# Altium project JD_BopIt.PrjPcb
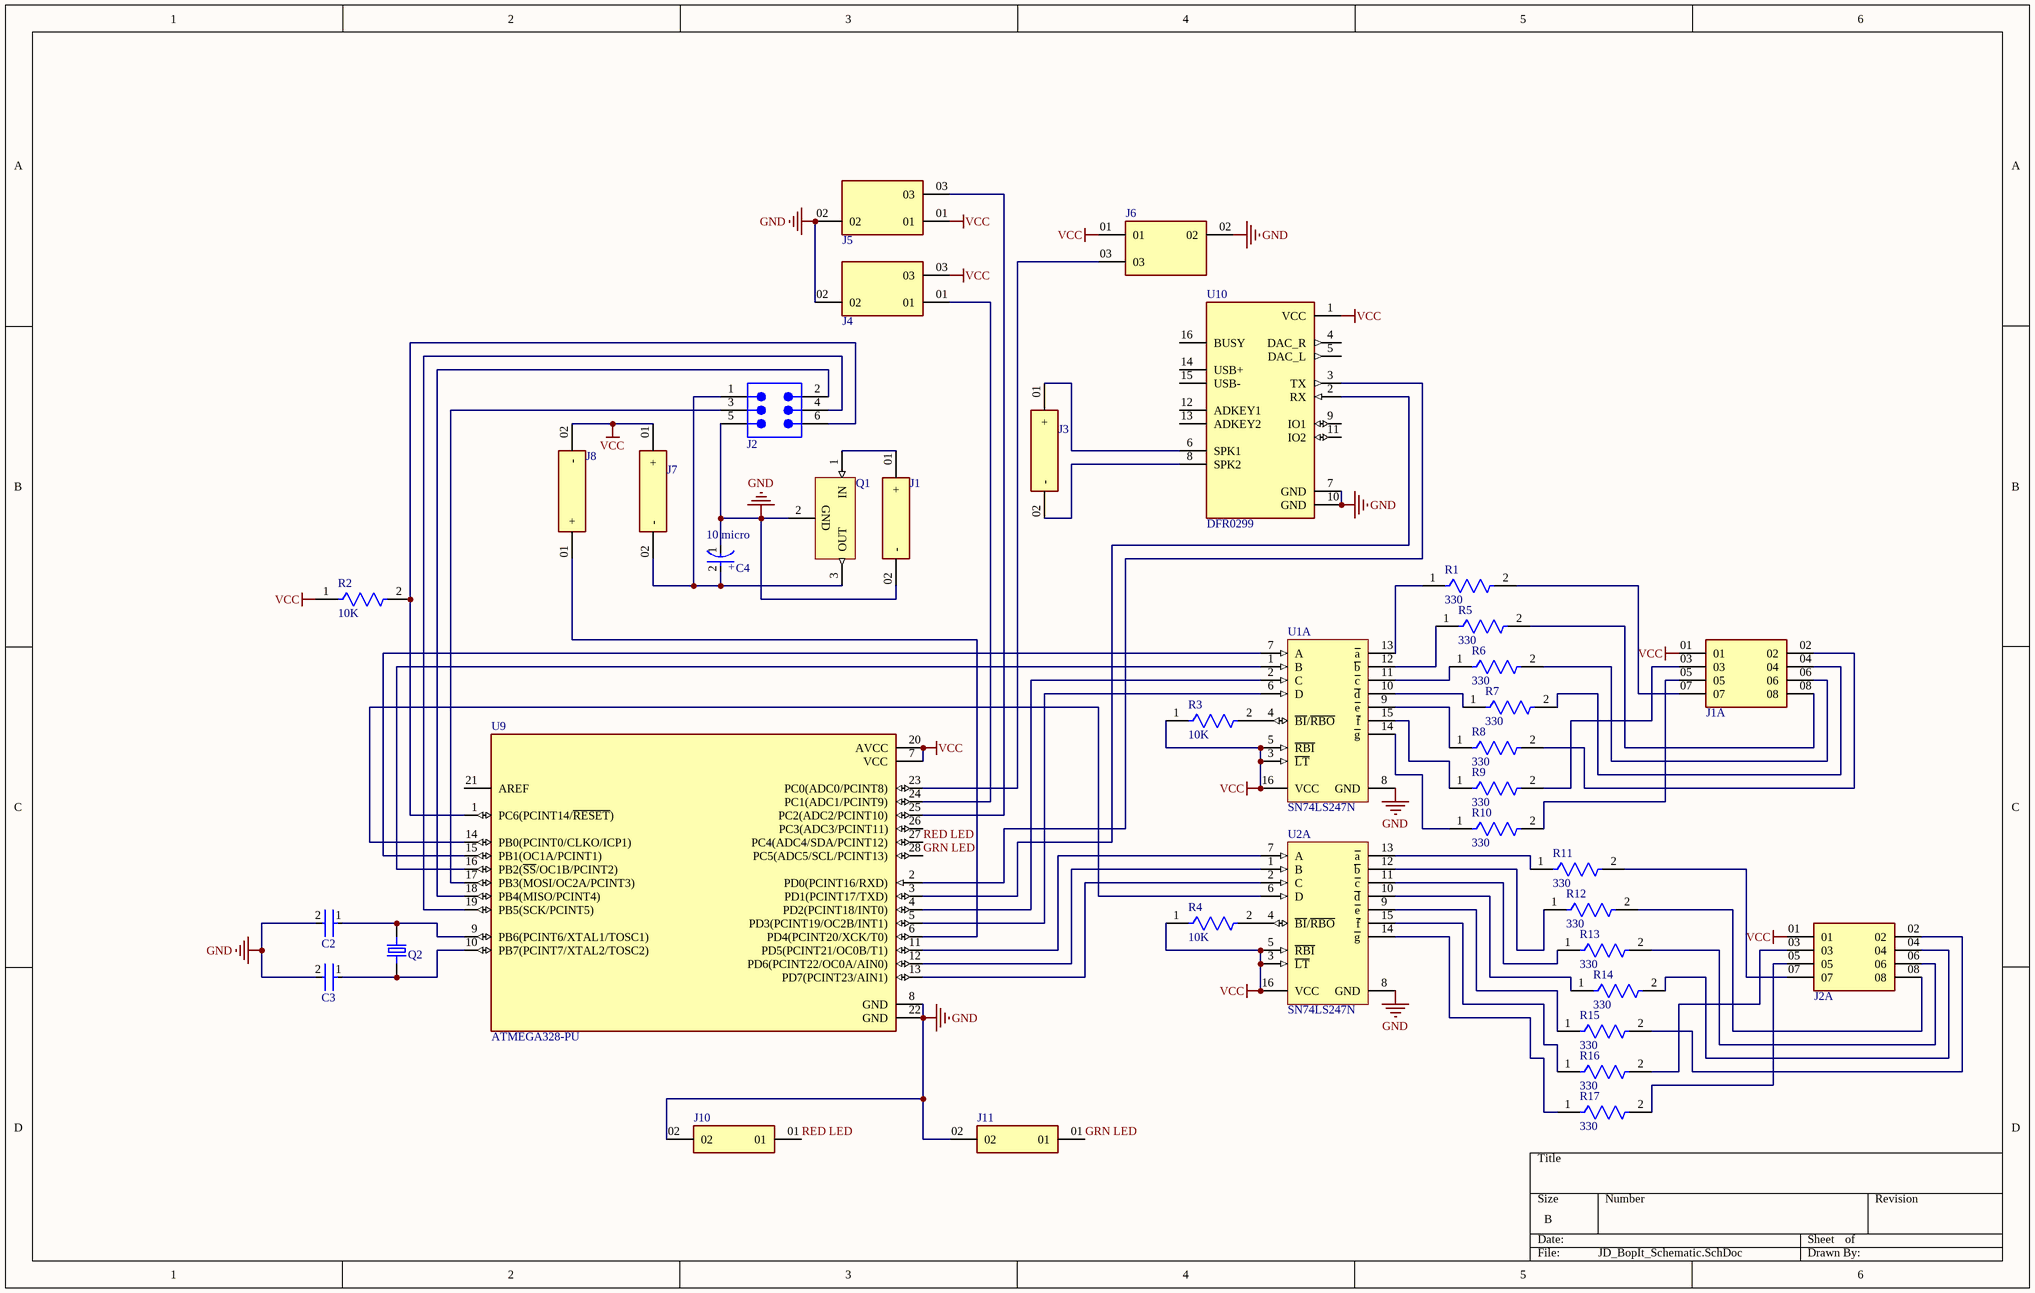
[diagram p0: JD_BopIt_Schematic.SchDoc]
1 sheet, 38 parts. Net scope: global (net labels, ports and power ports of the same name join across sheets).
Board file: JD_BopIt_PCB.PcbDoc

## Sheet JD_BopIt_Schematic.SchDoc
size B; SheetNumber: 1; SheetTotal: 1

### Parts
C2  RCE5C2A220J0DBH03A  [FP-RCE0DB-MFG]  (value not drawn)
C3  RCE5C2A220J0DBH03A  [FP-RCE0DB-MFG]  (value not drawn)
C4  10 micro  [FP-173DW-MFG]
J1  MTSW-101-09-T-D-231-LL  [SAMTEC_MTSW-101-09-T-D-231-LL]  (value not drawn)
J1A  TSW-104-09-L-D  [SAMTEC_TSW-104-09-L-D]  (value not drawn)
J2  61200621621  [61200621621]  (value not drawn)
J2A  TSW-104-09-L-D  [SAMTEC_TSW-104-09-L-D]  (value not drawn)
J3  MTSW-101-09-T-D-231-LL  [SAMTEC_MTSW-101-09-T-D-231-LL]  (value not drawn)
J4  HTSW-101-07-S-T  [SAMTEC_HTSW-101-07-S-T]  (value not drawn)
J5  HTSW-101-07-S-T  [SAMTEC_HTSW-101-07-S-T]  (value not drawn)
J6  HTSW-101-07-S-T  [SAMTEC_HTSW-101-07-S-T]  (value not drawn)
J7  MTSW-101-09-T-D-231-LL  [SAMTEC_MTSW-101-09-T-D-231-LL]  (value not drawn)
J8  MTSW-101-09-T-D-231-LL  [SAMTEC_MTSW-101-09-T-D-231-LL]  (value not drawn)
J10  MTSW-101-09-T-D-231-LL  [SAMTEC_MTSW-101-09-T-D-231-LL]  (value not drawn)
J11  MTSW-101-09-T-D-231-LL  [SAMTEC_MTSW-101-09-T-D-231-LL]  (value not drawn)
Q1  LM7805CT  [FAIR-TO-220-3]  (value not drawn)
Q2  ECS-160-S-4  [XTAL_ECS-160-20-4X]  (value not drawn)
R1  330  [FP-MBB0207-MFG]
R2  10K  [FP-MBB0207-MFG]
R3  10K  [FP-MBB0207-MFG]
R4  10K  [FP-MBB0207-MFG]
R5  330  [FP-MBB0207-MFG]
R6  330  [FP-MBB0207-MFG]
R7  330  [FP-MBB0207-MFG]
R8  330  [FP-MBB0207-MFG]
R9  330  [FP-MBB0207-MFG]
R10  330  [FP-MBB0207-MFG]
R11  330  [FP-MBB0207-MFG]
R12  330  [FP-MBB0207-MFG]
R13  330  [FP-MBB0207-MFG]
R14  330  [FP-MBB0207-MFG]
R15  330  [FP-MBB0207-MFG]
R16  330  [FP-MBB0207-MFG]
R17  330  [FP-MBB0207-MFG]
U1A  SN74LS247N  [N0016A]
U2A  SN74LS247N  [N0016A]
U9  ATMEGA328-PU  [DIP787W46P254L3467H508Q28]
U10  DFR0299  [MODULE_DFR0299]

### Nets
GND: C2.2 C3.2 C4.1(C) J1.02(-) J2.5 J4.02 J5.02 J6.02 J10.02 J11.02 Q1.2(GND) U1A.8(GND) U2A.8(GND) U9.8(GND) U9.22(GND) U10.7(GND) U10.10(GND)
VCC: J1A.01 J2A.01 J4.03 J5.01 J6.01 J7.01(+) J8.02(-) R2.1 R3.1 R4.1 U1A.3(~{LT}) U1A.5(~{RBI}) U1A.16(VCC) U2A.3(~{LT}) U2A.5(~{RBI}) U2A.16(VCC) U9.7(VCC) U9.20(AVCC) U10.1(VCC)
GRN LED: J11.01 U9.28(PC5(ADC5/SCL/PCINT13))
RED LED: J10.01 U9.27(PC4(ADC4/SDA/PCINT12))
NetC2_1: C2.1 Q2.2 U9.9(PB6(PCINT6/XTAL1/TOSC1))
NetC3_1: C3.1 Q2.1 U9.10(PB7(PCINT7/XTAL2/TOSC2))
NetC4_2: C4.2(A) J2.1 J7.02(-) Q1.3(OUT)
NetJ1_01: J1.01(+) Q1.1(IN)
NetJ1A_02: J1A.02 R8.2
NetJ1A_03: J1A.03 R9.2
NetJ1A_04: J1A.04 R7.2
NetJ1A_05: J1A.05 R10.2
NetJ1A_06: J1A.06 R6.2
NetJ1A_07: J1A.07 R1.2
NetJ1A_08: J1A.08 R5.2
NetJ2_2: J2.2 U9.18(PB4(MISO/PCINT4))
NetJ2_3: J2.3 U9.17(PB3(MOSI/OC2A/PCINT3))
NetJ2_4: J2.4 U9.19(PB5(SCK/PCINT5))
NetJ2_6: J2.6 R2.2 U9.1(PC6(PCINT14/~{RESET}))
NetJ2A_02: J2A.02 R15.2
NetJ2A_03: J2A.03 R16.2
NetJ2A_04: J2A.04 R14.2
NetJ2A_05: J2A.05 R17.2
NetJ2A_06: J2A.06 R13.2
NetJ2A_07: J2A.07 R11.2
NetJ2A_08: J2A.08 R12.2
NetJ3_01: J3.01(+) U10.6(SPK1)
NetJ3_02: J3.02(-) U10.8(SPK2)
NetJ4_01: J4.01 U9.24(PC1(ADC1/PCINT9))
NetJ5_03: J5.03 U9.25(PC2(ADC2/PCINT10))
NetJ6_03: J6.03 U9.23(PC0(ADC0/PCINT8))
NetJ8_01: J8.01(+) U9.6(PD4(PCINT20/XCK/T0))
NetR1_1: R1.1 U1A.13(~{a})
NetR3_2: R3.2 U1A.4(~{BI}/~{RBO})
NetR4_2: R4.2 U2A.4(~{BI}/~{RBO})
NetR5_1: R5.1 U1A.12(~{b})
NetR6_1: R6.1 U1A.11(~{c})
NetR7_1: R7.1 U1A.10(~{d})
NetR8_1: R8.1 U1A.9(~{e})
NetR9_1: R9.1 U1A.15(~{f})
NetR10_1: R10.1 U1A.14(~{g})
NetR11_1: R11.1 U2A.13(~{a})
NetR12_1: R12.1 U2A.12(~{b})
NetR13_1: R13.1 U2A.11(~{c})
NetR14_1: R14.1 U2A.10(~{d})
NetR15_1: R15.1 U2A.9(~{e})
NetR16_1: R16.1 U2A.15(~{f})
NetR17_1: R17.1 U2A.14(~{g})
NetU1A_1: U1A.1(B) U9.16(PB2(~{SS}/OC1B/PCINT2))
NetU1A_2: U1A.2(C) U9.4(PD2(PCINT18/INT0))
NetU1A_6: U1A.6(D) U9.5(PD3(PCINT19/OC2B/INT1))
NetU1A_7: U1A.7(A) U9.15(PB1(OC1A/PCINT1))
NetU2A_1: U2A.1(B) U9.12(PD6(PCINT22/OC0A/AIN0))
NetU2A_2: U2A.2(C) U9.13(PD7(PCINT23/AIN1))
NetU2A_6: U2A.6(D) U9.14(PB0(PCINT0/CLKO/ICP1))
NetU2A_7: U2A.7(A) U9.11(PD5(PCINT21/OC0B/T1))
NetU9_2: U9.2(PD0(PCINT16/RXD)) U10.3(TX)
NetU9_3: U9.3(PD1(PCINT17/TXD)) U10.2(RX)

Not connected (* = marked no-connect by the designer): U9 21(AREF) 26(PC3(ADC3/PCINT11)); U10 4(DAC_R) 5(DAC_L) 9(IO1) 11(IO2) 12(ADKEY1) 13(ADKEY2) 14(USB+) 15(USB-) 16(BUSY)

### Notes on the sheet
- (in symbol CMP-00030-42256642-1) +

### Library data of the parts
C2 C3 = CMP-06035-047347-1: Cap Ceramic 22pF 100V C0G ±5% Radial 2.5mm +125°C Ammo Pack; Lead Diameter: 0.5mm; Lead/Base Style: Straight; Height: 3.5mm; Voltage: 100V; Mount: Through Hole; Min Operating Temperature: -55°C; Height - Seated (Max): 0.138inch; Dielectric: C0G; Width: 0.098inch; Depth: 2.5mm; Lead Pitch: 0.098inch; Packaging: Tape and Reel; Voltage Rating (DC): 100V; Capacitance: 22pF; Package Quantity: 2000; Max Operating Temperature: 125°C; Tolerance: 5%; Termination: Radial; Voltage Rating: 100V; Case/Package: Radial; Resistor Type: Ceramic; Length: 3.6mm; Ratings: AEC-Q200
C4 = CMP-00030-42256642-1: 173D106X9025WWE3 173D Series 10 uF ±10% 25 V Axial Solid Electrolyte Tantalum Capacitor; Voltage Rating: 25V; Polarity: Polar; Leakage Current: 1.5µA; Lead Diameter: 510µm; Capacitance: 10µF; Dissipation Factor: 4%; REACH SVHC: Unknown; Length: 8.76mm; Packaging: Cut Tape (CT); Max Operating Temperature: 85°C; Case/Package: Axial; Mount: Through Hole; Voltage Rating (DC): 25V; Height: 4.57mm; Depth: 4.57mm; NexarPartId: 42256642; RoHS: Compliant; Lead Free: Lead Free; Termination: Axial; Contact Plating: Tin; Number of Pins: 2; Schedule B: 8532210080, 8532210080; Radiation Hardening: No; Min Operating Temperature: -55°C; Features: General Purpose; Tolerance: 10%; Diameter: 4.572mm
J2 = 61200621621: WR-BHD Male Box Header, THT Straight, pitch 2.54mm, 2 row, 6 pin; Manufacturer: Wurth Elektronik; Contact Resistance: 20mOhm; Insulation Resistance: 1000MOhm; Rated Current: 3A; Working Voltage: 250V; Withstanding Voltage: 500V; Manufacturer Part Number: 61200621621; Category: Wire-to-Board Connectors; Match Code: WR-BHD; ComponentLink1Description: Website Link; ComponentLink1URL: https://www.we-online.com/redexpert/article/61200621621?ad; ComponentLink2Description: Datasheet Link; ComponentLink2URL: https://www.we-online.com/redexpert/spec/61200621621?ad; Mount: Through Hole; Operating Temperature Max: 105°C; Operating Temperature Min: -40°C; Packaging: Tray; Length: 15.28mm; Width: 9.1mm; Height: 9.1mm; Gender: Male; Number of Pins: 6; Number of Rows: 2; Orientation: Straight; Pitch: 2.54mm
J4-J6 = HTSW-101-07-S-T: Connector Header Through Hole 3 position; MF: Samtec; SnapEDA_Link: https://www.snapeda.com/parts/HTSW-101-07-S-T/Samtec/view-part/?ref=snap; Package: None; Value: *; MP: HTSW-101-07-S-T; Check_prices: https://www.snapeda.com/parts/HTSW-101-07-S-T/Samtec/view-part/?ref=eda
Q1 = CMP-2000-04938-1: Positive Voltage Regulator, 5 V, 1 A, -40 to 125 degC, 3-Pin TO-220, RoHS, Tube; Manufacturer: FairchildSemiconductor; Maximum Input Voltage: 35V; Maximum Quiescent Current: 8mA; Load Regulation: 100mV; Maximum Output Current: 2.2(Typ)A; Output Type: Fixed; Typical Dropout Voltage @ Current: 2@1AV; Rad Hard: No; Output Voltage: 5V; Accuracy: ±4%; Type: Linear; Number of Outputs: 1; Category: LinearRegulator; Package Description: 3-Pin Through Hole Device, Body 10 x 4.5 mm, Pitch 2.54 mm; Packaging: Rail/Tube; Mounting: ThroughHole; Polarity: Positive; Manufacturer URL: https://www.fairchildsemi.com/; Line Regulation: 100mV; Datasheet Version: Aug-12; Datasheet URL: https://datasheet.ciiva.com/26904/lm7805ct-26904988.pdf; Package Reference: TO-220; Package URL: https://www.fairchildsemi.com/package-drawings/TO/TO220B03.pdf; Package: 3TO-220AB; Operating Temperature: -40to125degC
Q2 = ECS-160-S-4: 16 MHz Â±30ppm Crystal Series 40 Ohms HC-49/US; MF: ECS Inc.; SnapEDA_Link: https://www.snapeda.com/parts/ECS-160-S-4/ECS/view-part/?ref=snap; Package: HC-49US ECS Inc.; Value: *; MP: ECS-160-S-4; Check_prices: https://www.snapeda.com/parts/ECS-160-S-4/ECS/view-part/?ref=eda
R1-R17 = CMP-02408-000035-1: RES 10K OHM 0.6W 1% AXIAL; Voltage Rating: 300V; Resistance: 10kR; Max Power Dissipation: 600mW; Temperature Coefficient: 50ppm/°C; Radiation Hardening: No; Case/Package: Conformal; Termination: Axial; Military Standard: Not; Length: 6.5mm; Voltage Rating (DC): 300V; RoHS Compliant: Yes; Number of Terminations: 2; Packaging: Tape and Reel; Features: Automotive AEC-Q200; Tolerance: 1%; Min Operating Temperature: -55°C; Power Rating: 600mW; Lead Free: Lead Free; Resistor Type: Metal Film; Construction: Cylindrical; Series: MBB 0207 - Professional; Max Operating Temperature: 155°C; Diameter: 2.5mm; Resistance Tolerance: 1%; Contact Plating: Tin; Technology: THIN FILM
U1A U2A = CMP-0388-00310-2: BCD-to-7-Segment Decoder / Driver, 4.75 to 5.25 V, 0 to 70 degC, 16-pin DIP (N16), Pb-Free (RoHS); Manufacturer: Texas Instruments; SubFamily: Discrete Segment LED Driver; Vin(Max)(V): 5.25; Rating: Catalog; Vin(Min)(V): 4.75; PackageVersion: 4040049/E; DatasheetVersion: SDLS083; PackageDescription: 16-Pin Plastic In-Line, Body 19.305 x 6.35 mm, Pitch 2.54 mm; ComponentLink2URL: http://www.ti.com/general/docs/lit/getliterature.tsp?genericPartNumber=SN74LS247&fileType=pdf; PartNumber: SN74LS247N; Mounting Technology: Through Hole; ComponentLink2Description: Datasheet; ComponentLink3Description: Package Specification; PackageReference: N0016A; Code_JEDEC: MS-001; ComponentLink3URL: http://www.ti.com/litv/pdf/mpdi002c; Eco-Plan: Pb-Free (RoHS); ComponentLink1Description: Manufacturer URL; ComponentLink1URL: http://www.ti.com/
U9 = ATMEGA328-PU: AVR AVRÂ® ATmega Microcontroller IC 8-Bit 20MHz 32KB (16K x 16) FLASH 28-PDIP; MF: Microchip; Availability: In Stock; MP: ATMEGA328-PU; SnapEDA_Link: https://www.snapeda.com/parts/ATMEGA328-PU/Microchip/view-part/?ref=snap; Value: *; Price: None; Purchase-URL: https://pricing.snapeda.com/search/part/ATMEGA328-PU/?ref=eda; Check_prices: https://www.snapeda.com/parts/ATMEGA328-PU/Microchip/view-part/?ref=eda; Package: DIP-28 Microchip Technology
U10 = DFR0299: - MP3 Player Audio Arduino Platform Evaluation Expansion Board; MF: DFRobot; SnapEDA_Link: https://www.snapeda.com/parts/DFR0299/DFRobot/view-part/?ref=snap; Package: None; Value: *; MP: DFR0299; Check_prices: https://www.snapeda.com/parts/DFR0299/DFRobot/view-part/?ref=eda
J1 J3 J7 J8 J10 J11 = MTSW-101-09-T-D-231-LL: Package: None; Price: None; Value: *; MP: MTSW-101-09-T-D-231-LL; Availability: Unavailable
J1A J2A = TSW-104-09-L-D: Package: None; Price: None; Value: *; MP: TSW-104-09-L-D; Availability: Unavailable